# Altium schematic sheet obc_rtc.SchDoc
size A4
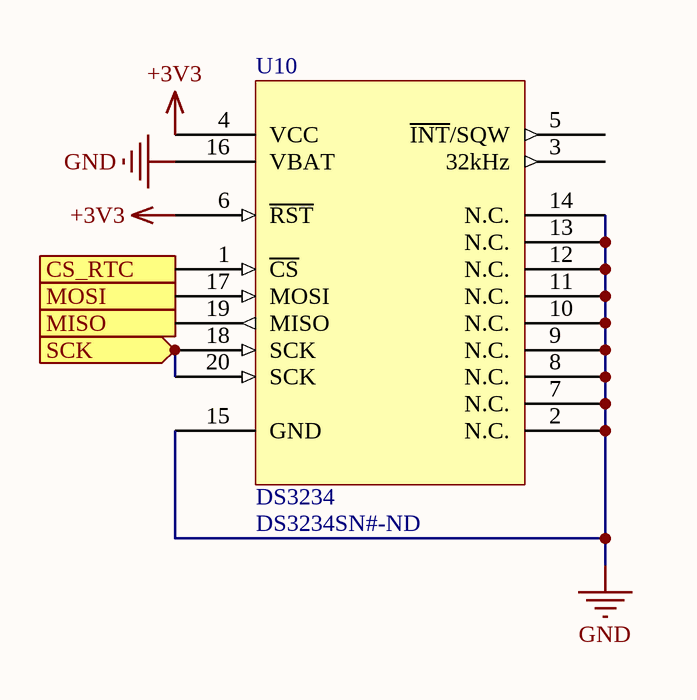
[diagram p0: obc_rtc.SchDoc]

## Parts
U10  DS3234  Supplier Part Number 1: DS3234SN#-ND  [SOIC127P1032X265-20N]

## Ports
CS_RTC (in), MISO (out), MOSI (in), SCK (in)

## Nets
+3V3: U10.4(VCC) U10.6(~{RST})
GND: U10.2(N.C.) U10.7(N.C.) U10.8(N.C.) U10.9(N.C.) U10.10(N.C.) U10.11(N.C.) U10.12(N.C.) U10.13(N.C.) U10.14(N.C.) U10.15(GND) U10.16(VBAT)
CS_RTC: U10.1(~{CS}) ; port CS_RTC
MISO: U10.19(MISO) ; port MISO
MOSI: U10.17(MOSI) ; port MOSI
SCK: U10.18(SCK) U10.20(SCK) ; port SCK

Not connected (* = marked no-connect by the designer): U10 3(32kHz) 5(~{INT}/SQW)

## Library data of the parts
U10 = DS3234: SPI bus RTC with integrated crystal and SRAM; Supplier 1: Digi-Key